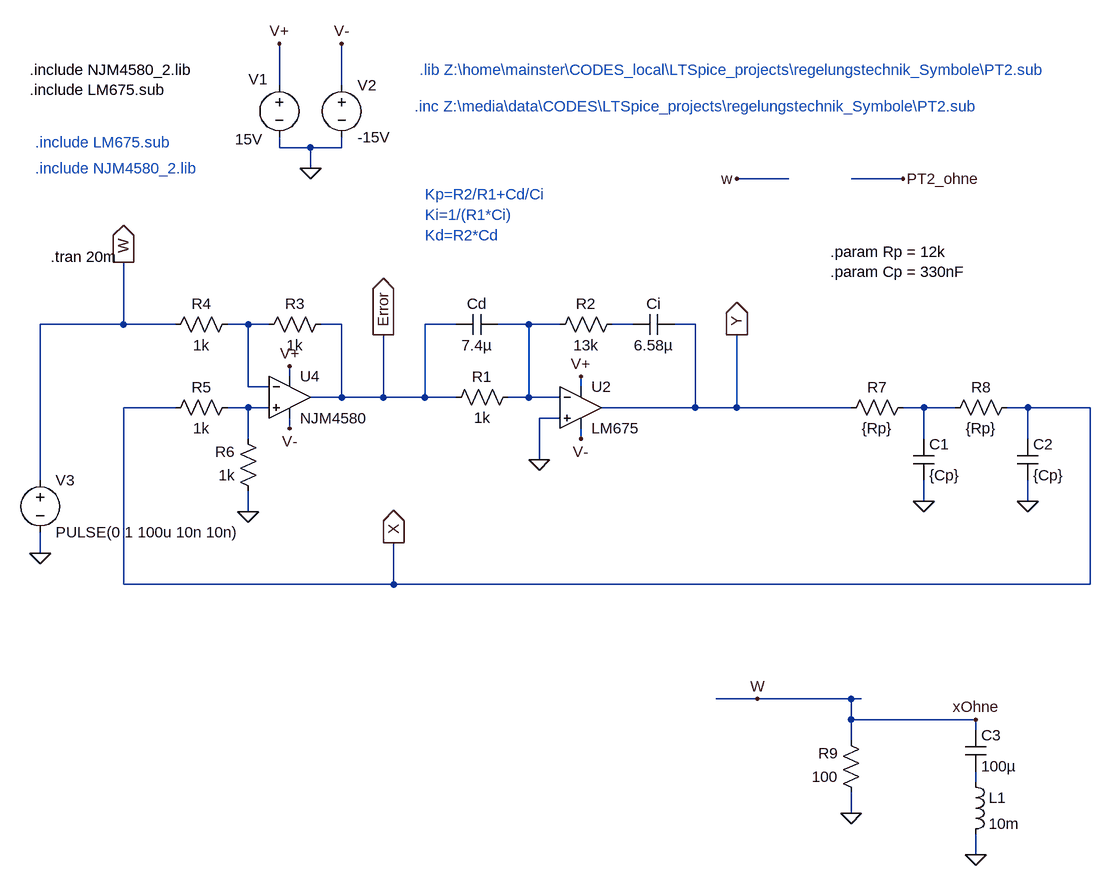
[diagram p0: schematic PID.asc]
PID.asc, the LTspice schematic file:
Version 4
SHEET 1 2100 1124
WIRE 704 -80 704 -144
WIRE 800 -80 800 -144
WIRE 704 16 704 0
WIRE 752 16 704 16
WIRE 800 16 800 0
WIRE 800 16 752 16
WIRE 752 48 752 16
WIRE 1488 64 1408 64
WIRE 1664 64 1584 64
WIRE 464 288 464 192
WIRE 464 288 336 288
WIRE 544 288 464 288
WIRE 656 288 624 288
WIRE 688 288 656 288
WIRE 800 288 768 288
WIRE 976 288 928 288
WIRE 1088 288 1040 288
WIRE 1136 288 1088 288
WIRE 1248 288 1216 288
WIRE 1344 288 1312 288
WIRE 720 368 720 352
WIRE 656 384 656 288
WIRE 688 384 656 384
WIRE 1168 384 1168 368
WIRE 800 400 800 288
WIRE 800 400 752 400
WIRE 864 400 864 304
WIRE 864 400 800 400
WIRE 928 400 928 288
WIRE 928 400 864 400
WIRE 976 400 928 400
WIRE 1088 400 1088 288
WIRE 1088 400 1056 400
WIRE 1136 400 1088 400
WIRE 544 416 464 416
WIRE 656 416 624 416
WIRE 688 416 656 416
WIRE 1344 416 1344 288
WIRE 1344 416 1200 416
WIRE 1408 416 1408 304
WIRE 1408 416 1344 416
WIRE 1584 416 1408 416
WIRE 1696 416 1664 416
WIRE 1744 416 1696 416
WIRE 1856 416 1824 416
WIRE 1952 416 1856 416
WIRE 1136 432 1104 432
WIRE 720 448 720 432
WIRE 656 464 656 416
WIRE 1168 464 1168 448
WIRE 1696 464 1696 416
WIRE 1856 464 1856 416
WIRE 1104 496 1104 432
WIRE 336 528 336 288
WIRE 1696 560 1696 528
WIRE 1856 560 1856 528
WIRE 656 576 656 544
WIRE 336 640 336 608
WIRE 464 688 464 416
WIRE 880 688 880 624
WIRE 880 688 464 688
WIRE 1952 688 1952 416
WIRE 1952 688 880 688
WIRE 1440 864 1376 864
WIRE 1584 864 1440 864
WIRE 1600 864 1584 864
WIRE 1584 896 1584 864
WIRE 1776 896 1584 896
WIRE 1776 912 1776 896
WIRE 1584 928 1584 896
WIRE 1776 992 1776 976
WIRE 1584 1040 1584 1008
WIRE 1776 1104 1776 1072
FLAG 336 640 0
FLAG 752 48 0
FLAG 704 -144 V+
FLAG 800 -144 V-
FLAG 1168 464 V-
FLAG 1168 368 V+
FLAG 1104 496 0
FLAG 720 448 V-
FLAG 720 352 V+
FLAG 656 576 0
FLAG 864 304 Error
IOPIN 864 304 Out
FLAG 464 192 W
IOPIN 464 192 Out
FLAG 1408 304 Y
IOPIN 1408 304 Out
FLAG 880 624 X
IOPIN 880 624 Out
FLAG 1408 64 w
FLAG 1664 64 PT2_ohne
FLAG 1696 560 0
FLAG 1856 560 0
FLAG 1776 1104 0
FLAG 1440 864 W
FLAG 1776 896 xOhne
FLAG 1584 1040 0
SYMBOL opamp2 1168 352 R0
SYMATTR InstName U2
SYMATTR Value LM675
SYMBOL voltage 704 -96 R0
WINDOW 123 0 0 Left 0
WINDOW 39 0 0 Left 0
WINDOW 0 -47 7 Left 0
WINDOW 3 -68 99 Left 0
SYMATTR InstName V1
SYMATTR Value 15V
SYMBOL voltage 800 -96 R0
WINDOW 123 0 0 Left 0
WINDOW 39 0 0 Left 0
SYMATTR InstName V2
SYMATTR Value -15V
SYMBOL voltage 336 512 R0
WINDOW 123 0 0 Left 0
WINDOW 39 0 0 Left 0
SYMATTR InstName V3
SYMATTR Value PULSE(0 1 100u 10n 10n)
SYMBOL res 1232 272 R90
WINDOW 0 0 56 VBottom 0
WINDOW 3 32 56 VTop 0
SYMATTR InstName R2
SYMATTR Value 13k
SYMBOL res 1072 384 R90
WINDOW 0 0 56 VBottom 0
WINDOW 3 32 56 VTop 0
SYMATTR InstName R1
SYMATTR Value 1k
SYMBOL cap 1040 272 R90
WINDOW 0 0 32 VBottom 0
WINDOW 3 32 32 VTop 0
SYMATTR InstName Cd
SYMATTR Value 7.4µ
SYMBOL cap 1312 272 R90
WINDOW 0 0 32 VBottom 0
WINDOW 3 32 32 VTop 0
SYMATTR InstName Ci
SYMATTR Value 6.58µ
SYMBOL opamp2 720 336 R0
SYMATTR InstName U4
SYMATTR Value NJM4580
SYMBOL res 784 272 R90
WINDOW 0 0 56 VBottom 0
WINDOW 3 32 56 VTop 0
SYMATTR InstName R3
SYMATTR Value 1k
SYMBOL res 640 272 R90
WINDOW 0 0 56 VBottom 0
WINDOW 3 32 56 VTop 0
SYMATTR InstName R4
SYMATTR Value 1k
SYMBOL res 640 400 R90
WINDOW 0 0 56 VBottom 0
WINDOW 3 32 56 VTop 0
SYMATTR InstName R5
SYMATTR Value 1k
SYMBOL res 672 560 R180
WINDOW 0 36 76 Left 0
WINDOW 3 36 40 Left 0
SYMATTR InstName R6
SYMATTR Value 1k
SYMBOL res 1680 400 R90
WINDOW 0 0 56 VBottom 0
WINDOW 3 32 56 VTop 0
SYMATTR InstName R7
SYMATTR Value {Rp}
SYMBOL cap 1680 464 R0
SYMATTR InstName C1
SYMATTR Value {Cp}
SYMBOL res 1840 400 R90
WINDOW 0 0 56 VBottom 0
WINDOW 3 32 56 VTop 0
SYMATTR InstName R8
SYMATTR Value {Rp}
SYMBOL cap 1840 464 R0
SYMATTR InstName C2
SYMATTR Value {Cp}
SYMBOL res 1600 1024 R180
WINDOW 0 36 76 Left 0
WINDOW 3 36 40 Left 0
SYMATTR InstName R9
SYMATTR Value 100
SYMBOL cap 1760 912 R0
SYMATTR InstName C3
SYMATTR Value 100µ
SYMBOL ind 1760 976 R0
SYMATTR InstName L1
SYMATTR Value 10m
TEXT 328 8 Left 0 ;.include LM675.sub
TEXT 928 88 Left 0 ;Kp=R2/R1+Cd/Ci\nKi=1/(R1*Ci)\nKd=R2*Cd
TEXT 352 184 Left 0 !.tran 20m
TEXT 912 -48 Left 0 ;.inc Z:\\media\\data\\CODES\\LTSpice_projects\\regelungstechnik_Symbole\\PT2.sub
TEXT 328 48 Left 0 ;.include NJM4580_2.lib
TEXT 320 -104 Left 0 !.include NJM4580_2.lib\n.include LM675.sub
TEXT 920 -104 Left 0 ;.lib Z:\\home\\mainster\\CODES_local\\LTSpice_projects\\regelungstechnik_Symbole\\PT2.sub
TEXT 1552 176 Left 0 !.param Rp = 12k\n.param Cp = 330nF

The netlist it stands for:
* PID.asc
XU2 0 N002 V+ V- Y LM675  ; pins In+ In- V+ V- OUT
V1 V+ 0 15V
V2 V- 0 -15V
V3 xOhne 0 PULSE(0 1 100u 10n 10n)
R2 N003 N002 13k
R1 N002 Error 1k
Cd N002 Error 7.4µ
Ci Y N003 6.58µ
XU4 N004 N001 V+ V- Error NJM4580  ; pins In+ In- V+ V- OUT
R3 Error N001 1k
R4 N001 xOhne 1k
R5 N004 X 1k
R6 0 N004 1k
R7 N005 Y {Rp}
C1 N005 0 {Cp}
R8 X N005 {Rp}
C2 X 0 {Cp}
R9 0 xOhne 100
C3 xOhne N006 100µ
L1 N006 0 10m
* .include LM675.sub
* Kp=R2/R1+Cd/Ci
* Ki=1/(R1*Ci)
* Kd=R2*Cd
.tran 20m
* .inc Z:\media\data\CODES\LTSpice_projects\regelungstechnik_Symbole\PT2.sub
* .include NJM4580_2.lib
.include NJM4580_2.lib
.include LM675.sub
* .lib Z:\home\mainster\CODES_local\LTSpice_projects\regelungstechnik_Symbole\PT2.sub
.param Rp = 12k
.param Cp = 330nF
.backanno
.end